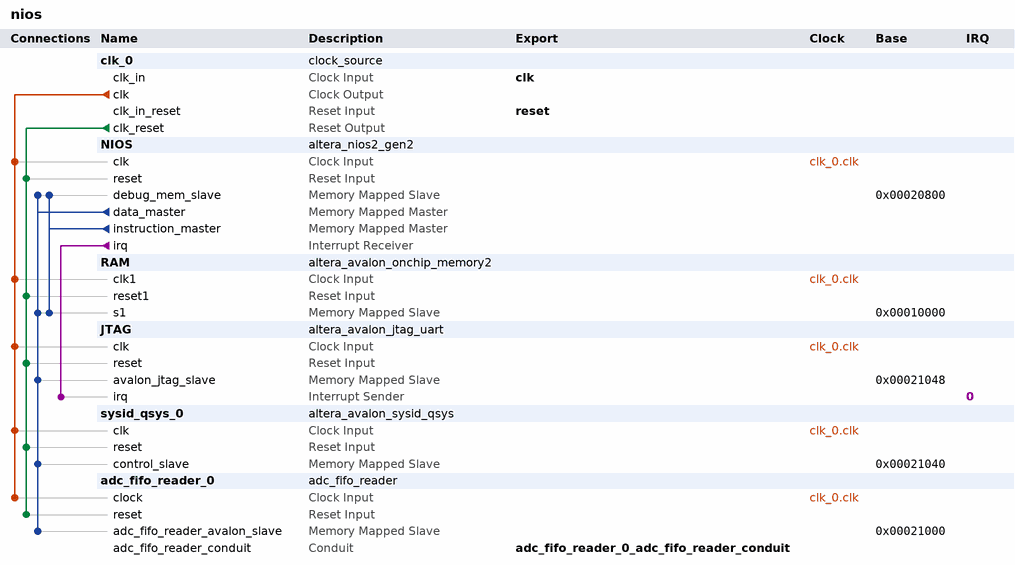
[diagram p0: system contents]
# Platform Designer (Qsys) system nios, Cyclone 10 LP 10CL025YU256I7G
# Parameters at their usual value, and those the tool derives, are not listed.
package require -exact qsys 23.1
create_system nios
set_project_property DEVICE_FAMILY {Cyclone 10 LP}
set_project_property DEVICE 10CL025YU256I7G

add_instance clk_0 clock_source 23.1
set_instance_parameter_value clk_0 clockFrequency 50000000

add_instance NIOS altera_nios2_gen2 23.1
set_instance_parameter_value NIOS dcache_size 2048
set_instance_parameter_value NIOS exceptionSlave RAM.s1
set_instance_parameter_value NIOS icache_size 4096
set_instance_parameter_value NIOS impl Tiny
set_instance_parameter_value NIOS resetSlave RAM.s1

add_instance RAM altera_avalon_onchip_memory2 23.1
set_instance_parameter_value RAM dataWidth 32
set_instance_parameter_value RAM dualPort false
set_instance_parameter_value RAM initMemContent true
set_instance_parameter_value RAM initializationFileName onchip_mem.hex
set_instance_parameter_value RAM memorySize 40960

add_instance JTAG altera_avalon_jtag_uart 23.1
set_instance_parameter_value JTAG simInteractiveOptions NO_INTERACTIVE_WINDOWS

add_instance sysid_qsys_0 altera_avalon_sysid_qsys 23.1
set_instance_parameter_value sysid_qsys_0 id 39011

add_instance adc_fifo_reader_0 adc_fifo_reader 1.0

# connections
add_connection clk_0.clk adc_fifo_reader_0.clock clock
add_connection clk_0.clk JTAG.clk clock
add_connection clk_0.clk NIOS.clk clock
add_connection clk_0.clk RAM.clk1 clock
add_connection clk_0.clk sysid_qsys_0.clk clock
add_connection clk_0.clk_reset adc_fifo_reader_0.reset reset
add_connection clk_0.clk_reset JTAG.reset reset
add_connection clk_0.clk_reset NIOS.reset reset
add_connection clk_0.clk_reset RAM.reset1 reset
add_connection clk_0.clk_reset sysid_qsys_0.reset reset
add_connection NIOS.data_master adc_fifo_reader_0.adc_fifo_reader_avalon_slave avalon
set_connection_parameter_value NIOS.data_master/adc_fifo_reader_0.adc_fifo_reader_avalon_slave baseAddress 0x00021000
add_connection NIOS.data_master JTAG.avalon_jtag_slave avalon
set_connection_parameter_value NIOS.data_master/JTAG.avalon_jtag_slave baseAddress 0x00021048
add_connection NIOS.data_master NIOS.debug_mem_slave avalon
set_connection_parameter_value NIOS.data_master/NIOS.debug_mem_slave baseAddress 0x00020800
add_connection NIOS.data_master RAM.s1 avalon
set_connection_parameter_value NIOS.data_master/RAM.s1 baseAddress 0x00010000
add_connection NIOS.data_master sysid_qsys_0.control_slave avalon
set_connection_parameter_value NIOS.data_master/sysid_qsys_0.control_slave baseAddress 0x00021040
add_connection NIOS.instruction_master NIOS.debug_mem_slave avalon
set_connection_parameter_value NIOS.instruction_master/NIOS.debug_mem_slave baseAddress 0x00020800
add_connection NIOS.instruction_master RAM.s1 avalon
set_connection_parameter_value NIOS.instruction_master/RAM.s1 baseAddress 0x00010000
add_connection NIOS.irq JTAG.irq interrupt
set_connection_parameter_value NIOS.irq/JTAG.irq irqNumber 0

# exported interfaces
add_interface adc_fifo_reader_0_adc_fifo_reader_conduit conduit end
set_interface_property adc_fifo_reader_0_adc_fifo_reader_conduit EXPORT_OF adc_fifo_reader_0.adc_fifo_reader_conduit
add_interface clk clock sink
set_interface_property clk EXPORT_OF clk_0.clk_in
add_interface reset reset sink
set_interface_property reset EXPORT_OF clk_0.clk_in_reset

set_interconnect_requirement {$system} qsys_mm.clockCrossingAdapter HANDSHAKE
set_interconnect_requirement {$system} qsys_mm.enableEccProtection FALSE
set_interconnect_requirement {$system} qsys_mm.insertDefaultSlave FALSE
set_interconnect_requirement {$system} qsys_mm.maxAdditionalLatency 1

save_system nios.qsys
